# Altium schematic sheet powerBoard.SchDoc
size A4
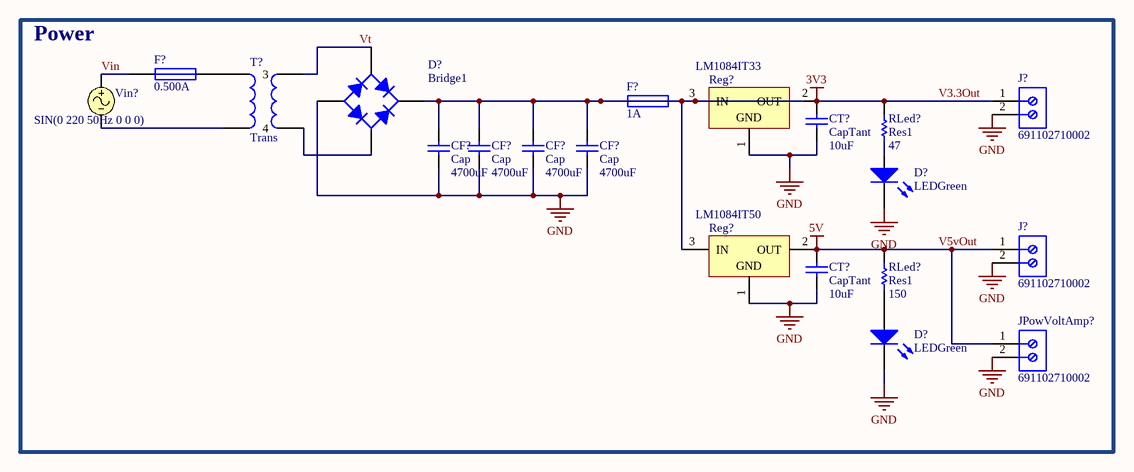
[diagram p0: powerBoard.SchDoc]

## Parts
(Parts that share a designator on the sheet are numbered #1, #2 ... from top to bottom, then left to right.)
CF?#1  Cap  value 4700uF  [4700uF]
CF?#2  Cap  value 4700uF  [4700uF]
CF?#3  Cap  value 4700uF  [4700uF]
CF?#4  Cap  value 4700uF  [4700uF]
CT?#1  CapTant  value 10uF  [RAD-0.3]
CT?#2  CapTant  value 10uF  [RAD-0.3]
D?#1  Bridge1  [DIOB_GBJ2510]
D?#2  LEDGreen  [LEDRD254W57D500H1070]
D?#3  LEDGreen  [LEDRD254W57D500H1070]
F?#1  0.500A  [PIN-W2/E2.8]
F?#2  1A  [PIN-W2/E2.8]
J?#1  691102710002  [691102710002]
J?#2  691102710002  [691102710002]
JPowVoltAmp?  691102710002  [691102710002]
Reg?#1  LM1084IT33  [NDE0003A]
Reg?#2  LM1084IT50  [NDE0003A]
RLed?#1  Res1  value 47  [AXIAL-0.3]
RLed?#2  Res1  value 150  [AXIAL-0.3]
T?  Trans  [691102710002]
Vin?  SIN(0 220 50Hz 0 0 0)

## Blocks framed on the sheet
Power: CF?#1-CF?#4 CT?#1 CT?#2 D?#1-D?#3 F?#1 F?#2 J?#1 J?#2 JPowVoltAmp? Reg?#1 Reg?#2 RLed?#1 RLed?#2 T? Vin?

## Nets
GND: CF?#1.1 CF?#2.1 CF?#3.1 CF?#4.1 CT?#1.1 CT?#2.1 D?#1.3(A) D?#2.2(K) D?#3.2(K) J?#1.2 J?#2.2 JPowVoltAmp?.2 Reg?#1.1(GND) Reg?#2.1(GND)
V3.3Out: CT?#1.2 J?#1.1 Reg?#1.2(OUT) RLed?#1.2  [also labelled 3V3]
V5vOut: CT?#2.2 J?#2.1 JPowVoltAmp?.1 Reg?#2.2(OUT) RLed?#2.2  [also labelled 5V]
Vin: F?#1.1 Vin?.1
Vt: D?#1.4(C) T?.3
NetCF?#1_2: CF?#1.2 CF?#2.2 CF?#3.2 CF?#4.2 D?#1.1(K) F?#2.1 F?#2.2 Reg?#1.3(IN) Reg?#2.3(IN)
NetD?#1_2: D?#1.2(C) T?.4
NetD?#2_1: D?#2.1(A) RLed?#1.1
NetD?#3_1: D?#3.1(A) RLed?#2.1
NetF?#1_2: F?#1.2 T?.1
NetT?_2: T?.2 Vin?.2

## Library data of the parts
CF?#1-CF?#4 = Cap: Capacitor; pin to pad: 1>NEG 2>POS; Published: 8-Jun-2000; LatestRevisionDate: 17-Jul-2002; LatestRevisionNote: Re-released for DXP Platform.; PackageReference: RAD-0.3; Publisher: Altium Limited; PackageDescription: Radial Cap, Thru-Hole; 2 Leads; 0.3 in Pin Spacing
CT?#1 CT?#2 = Cap: Capacitor; Published: 8-Jun-2000; LatestRevisionDate: 17-Jul-2002; LatestRevisionNote: Re-released for DXP Platform.; PackageReference: RAD-0.3; Publisher: Altium Limited; PackageDescription: Radial Cap, Thru-Hole; 2 Leads; 0.3 in Pin Spacing
D?#1 = Bridge1: Full Wave Diode Bridge; pin to pad: 2>3 3>4 4>2; Published: 8-Jun-2000; LatestRevisionDate: 29-May-2009; LatestRevisionNote: Sch pins A & K swapped.; DatasheetVersion: E2732B; PackageReference: D-38; Publisher: Altium Limited; PackageDescription: Bridge Rectifier; 4 Terminals; Body 9.4 x 9.4 mm (typ); Pitch 5.08 mm
D?#2 D?#3 = LED2: Typical RED, GREEN, YELLOW, AMBER GaAs LED; pin to pad: 1>A 2>C; Published: 8-Jun-2000; LatestRevisionDate: 17-Jul-2002; LatestRevisionNote: Re-released for DXP Platform.; PackageVersion: Feb-2002; PackageReference: 3.2X1.6X1.1; Publisher: Altium Limited; PackageDescription: SM LED; 2 Flat Leads
F?#1 = Fuse 1: Fuse; Published: 8-Jun-2000; LatestRevisionDate: 17-Jul-2002; LatestRevisionNote: Re-released for DXP Platform.; PackageReference: PIN-W2/E2.8; Publisher: Altium Limited; PackageDescription: Thru-Hole; 2 Leads
F?#2 = Fuse 1: 3.15A; Published: 8-Jun-2000; LatestRevisionDate: 17-Jul-2002; LatestRevisionNote: Re-released for DXP Platform.; PackageReference: PIN-W2/E2.8; Publisher: Altium Limited; PackageDescription: Thru-Hole; 2 Leads
J?#1 J?#2 JPowVoltAmp? = CMP-1502-03258-1: Series 102 - 5.00 mm Horizontal Entry Modular with Pressure Clamp WR-TBL, 2 pin; Manufacturer: Wurth Elektronik; Pin Number: 2; Pitch: 5.00mm; Manufacturer URL: http://www.we-online.de; Mounting Technology: THT; Publisher: WurthElektronik; Packaging: Box; Package Reference: 691102710002; Datasheet URL: http://katalog.we-online.de/em/datasheet/6911027100xx.pdf; Operating Temperature: -40to105degC; Part Number: 691102710002
Reg?#1 = CMP-0062-02533-3: 5A Low Dropout Positive Regulators, 3-pin TO-220, Pb-Free; Manufacturer: Texas Instruments; PowerWise: N; PackageTopMarking: NSUZXYTTE#*LM1084*IT-3.3; CompType: LDO IC; ComponentLink1Description: Datasheet URL; PackageReference: NDE0003A; PinCount: 3; RoHS: Y; ComponentLink1URL: http://www.ti.com/general/docs/lit/getliterature.tsp?genericPartNumber=LM1084&fileType=pdf; PackageDescription: TO-220, Molded, 3 Lead, Straight
Reg?#2 = CMP-0062-02537-3: 5A Low Dropout Positive Regulators, 3-pin TO-220, Pb-Free; Manufacturer: Texas Instruments; PowerWise: N; PackageTopMarking: NSUZXYTTE#*LM1084*IT-5.0; CompType: LDO IC; PackageDescription: TO-220, Molded, 3 Lead, Straight; ComponentLink1URL: http://www.ti.com/general/docs/lit/getliterature.tsp?genericPartNumber=LM1084&fileType=pdf; PackageReference: NDE0003A; RoHS: Y; PinCount: 3; ComponentLink1Description: Datasheet URL
RLed?#1 RLed?#2 = Res1: Resistor; Published: 8-Jun-2000; LatestRevisionDate: 17-Jul-2002; LatestRevisionNote: Re-released for DXP Platform.; PackageReference: AXIAL-0.3; Publisher: Altium Limited; PackageDescription: Axial Device, Thru-Hole; 2 Leads; 0.3 in Pin Spacing
T? = Trans: Transformer; pin to pad: 1>none 2>none 3>1 4>2; Published: 24-Mar-1999; LatestRevisionDate: 08-Jul-2005; LatestRevisionNote: Mech Layer 1 removed.; PackageReference: TRANS; Publisher: Altium Limited; PackageDescription: Transformer; 4 Leads
Vin? = VSIN: Sinusoidal Voltage Source; Note: PCB Footprint - Not required; Offset: 0; Amplitude: 169.7056275; Frequency: 60Hz; AC Magnitude: 1; Published: 8-Jun-2000; LatestRevisionDate: 15-Nov-2004; LatestRevisionNote: Corrected Netlist.; PackageReference: Not Applicable; Publisher: Altium Limited; Delay: 0; Damping Factor: 0; Phase: 0; DC Magnitude: 0; AC Phase: 0